# EAGLE schematic Tilty Omni (EAGLE 6.5.0)
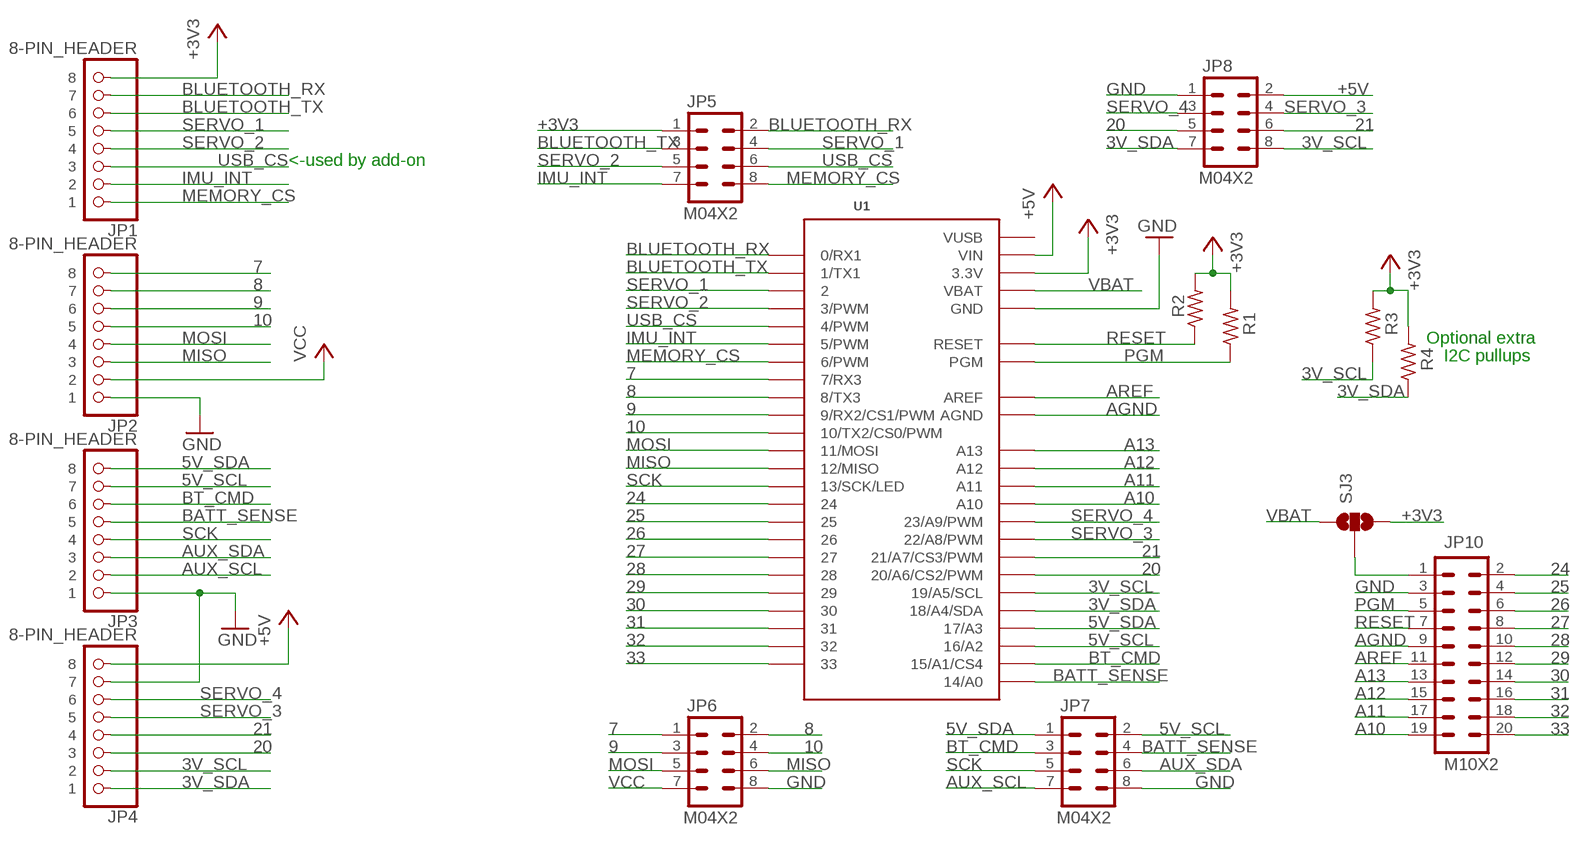
[diagram p0: schematic, sheet 1]

## Parts
JP1  8-PIN_HEADER  [8-PIN_RECEPTACLE_LOCK_NO-SS]
JP2  8-PIN_HEADER  [8-PIN_RECEPTACLE_LOCK_NO-SS]
JP3  8-PIN_HEADER  [8-PIN_RECEPTACLE_LOCK_NO-SS]
JP4  8-PIN_HEADER  [8-PIN_RECEPTACLE_LOCK_NO-SS]
JP5  M04X2  [2X4]
JP6  M04X2  [2X4]
JP7  M04X2  [2X4]
JP8  M04X2  [2X4]
JP10  M10X2  [2X10]
R1  10k  R-US_R0603  [R0603]
R2  10k  R-US_R0603  [R0603]
R3  10k  R-US_R0603  [R0603]
R4  10k  R-US_R0603  [R0603]
SJ3  SOLDERJUMPER_2WAYPASTE2&3  [SJ_3_PASTE2&3]
U1  TEENSY_3.0_ALLPINS  [TEENSY_3.0_ALLPINS]

## Nets
3V_SCL: JP4.P$2 JP8.8 R3.1 U1.19/A5(19/A5/SCL)
3V_SDA: JP4.P$1 JP8.7 R4.1 U1.18/A4(18/A4/SDA)
5V_SCL: JP3.P$7 JP7.2 U1.16/A2
5V_SDA: JP3.P$8 JP7.1 U1.17/A3
7: JP2.P$8 JP6.1 U1.7(7/RX3)
8: JP2.P$7 JP6.2 U1.8(8/TX3)
9: JP2.P$6 JP6.3 U1.9(9/RX2/CS1/PWM)
10: JP2.P$5 JP6.4 U1.10(10/TX2/CS0/PWM)
20: JP4.P$3 JP8.5 U1.20/A6(20/A6/CS2/PWM)
21: JP4.P$4 JP8.6 U1.21/A7(21/A7/CS3/PWM)
24: JP10.2 U1.24
25: JP10.4 U1.25
26: JP10.6 U1.26
27: JP10.8 U1.27
28: JP10.10 U1.28
29: JP10.12 U1.29
30: JP10.14 U1.30
31: JP10.16 U1.31
32: JP10.18 U1.32
33: JP10.20 U1.33
+3V3: JP1.P$8 JP5.1 R1.2 R2.2 R3.2 R4.2 SJ3.3 U1.3.3V U1.3.3V1(3.3V) U1.3.3V2(3.3V)
+5V: JP4.P$8 JP8.2 U1.VIN
A10: JP10.19 U1.A10
A11: JP10.17 U1.A11
A12: JP10.15 U1.A12
A13: JP10.13 U1.A13
AGND: JP10.9 U1.AGND
AREF: JP10.11 U1.AREF
AUX_SCL: JP3.P$2 JP7.7
AUX_SDA: JP3.P$3 JP7.6
BATT_SENSE: JP3.P$5 JP7.4 U1.14/A0
BLUETOOTH_RX: JP1.P$7 JP5.2 U1.0(0/RX1)
BLUETOOTH_TX: JP1.P$6 JP5.3 U1.1(1/TX1)
BT_CMD: JP3.P$6 JP7.3 U1.15/A1(15/A1/CS4)
GND: JP2.P$1 JP3.P$1 JP4.P$7 JP6.8 JP7.8 JP8.1 JP10.3 U1.GND U1.GND1(GND) U1.GND2(GND)
IMU_INT: JP1.P$2 JP5.7 U1.5(5/PWM)
MEMORY_CS: JP1.P$1 JP5.8 U1.6(6/PWM)
MISO: JP2.P$3 JP6.6 U1.12(12/MISO)
MOSI: JP2.P$4 JP6.5 U1.11(11/MOSI)
N$2: JP10.1 SJ3.2
PGM: JP10.5 R1.1 U1.PGM
RESET: JP10.7 R2.1 U1.RESET
SCK: JP3.P$4 JP7.5 U1.13(13/SCK/LED)
SERVO_1: JP1.P$5 JP5.4 U1.2
SERVO_2: JP1.P$4 JP5.5 U1.3(3/PWM)
SERVO_3: JP4.P$5 JP8.4 U1.22/A8(22/A8/PWM)
SERVO_4: JP4.P$6 JP8.3 U1.23/A9(23/A9/PWM)
USB_CS: JP1.P$3 JP5.6 U1.4(4/PWM)
VBAT: SJ3.1 U1.VBAT
VCC: JP2.P$2 JP6.7

## Notes on the sheet
- <-used by add-on
- Optional extra
- I2C pullups

## Power pins joined to a net without a drawn wire
VUSB: U1.VUSB

## Library data of the parts
JP1-JP4 = My Parts:8-PIN_HEADER
JP5-JP8 = SparkFun-Connectors:M04X2: .1" header, two rows of four.
JP10 = SparkFun-Connectors:M10X2: This was SPECIALLY designed to be used with our Graphic LCD Backpack. Be sure you want to use this! It is not only staggered on each line of header holes, but IT IS ALSO offset of the center point of the top and bottom lines by 5 mil. This causes the headers to lock into place on the "standard" footprint on the LCD screen. The extra squares on the tdocu layer are there simply to reference other pins (if you were to actually populate a longer header than ten long - this is what we do with the backpacks).
R1-R4 = resistor:R-US_: RESISTOR, American symbol
SJ3 = SparkFun-Passives:SOLDERJUMPER_2WAY: Solder Jumper 2 way solder jumper
U1 = Teensy3.0:TEENSY_3.0_ALLPINS: Teensy 3.0 with all pin holes and optional SMD-mount unshrouded header on bottom of Teensy 3.0. For more basic versions, see 'Basic', '+4' and 'AllAnalogPins'. Requires the installation of a un-shrouded SMD header on the underside of the Teensy 3.0